# Altium schematic sheet Forward Loom.SchDoc
size A4; SheetNumber: 1; SheetTotal: 3
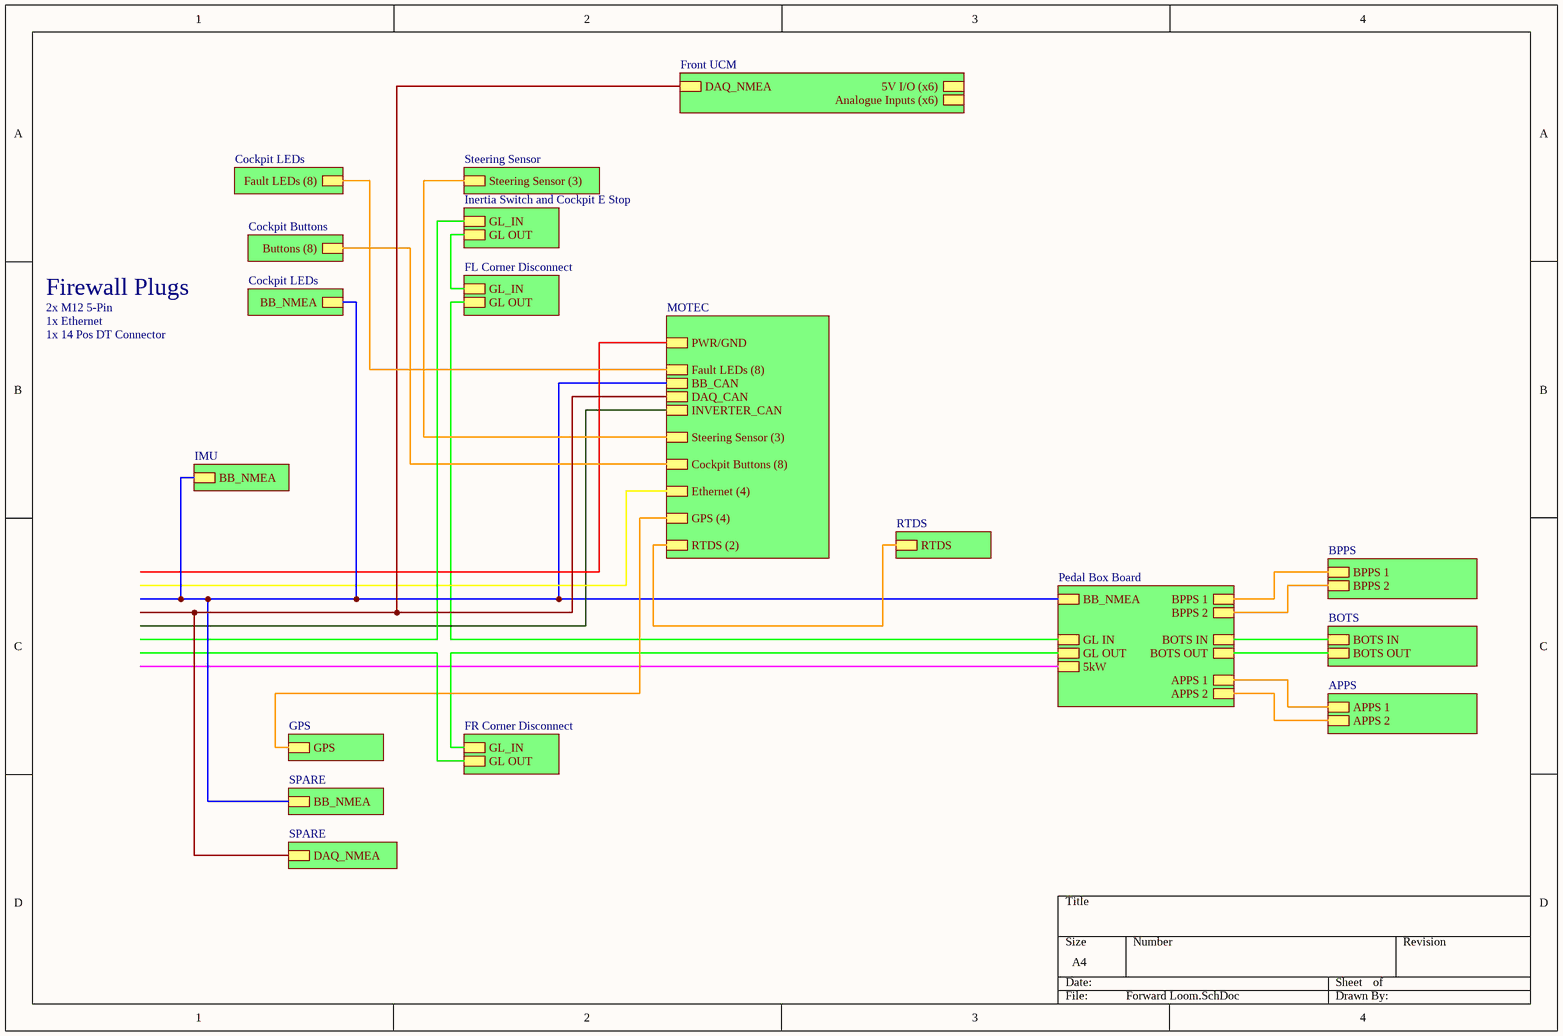
[diagram p0: Forward Loom.SchDoc]

## Sub-sheets
APPS = File Name: APPS 1, APPS 2
BOTS = File Name: BOTS IN, BOTS OUT
BPPS = File Name: BPPS 1, BPPS 2
Cockpit Buttons = File Name: Buttons (8)
Cockpit LEDs = File Name: BB_NMEA
Cockpit LEDs = File Name: Fault LEDs (8)
FL Corner Disconnect = File Name: GL_IN, GL OUT
FR Corner Disconnect = File Name: GL_IN, GL OUT
Front UCM = File Name: DAQ_NMEA, 5V I/O (x6), Analogue Inputs (x6)
GPS = File Name: GPS
IMU = File Name: BB_NMEA
Inertia Switch and Cockpit E Stop = File Name: GL_IN, GL OUT
MOTEC = File Name: PWR/GND, BB_CAN, DAQ_CAN, INVERTER_CAN, Steering Sensor (3), Cockpit Buttons (8), Ethernet (4), GPS (4), RTDS (2), Fault LEDs (8)
Pedal Box Board = File Name: BPPS 1, BPPS 2, BOTS IN, BOTS OUT, APPS 1, APPS 2, BB_NMEA, GL IN, GL OUT, 5kW
RTDS = File Name: RTDS
SPARE = File Name: BB_NMEA
SPARE = File Name: DAQ_NMEA
Steering Sensor = File Name: Steering Sensor (3)

## Nets
(unnamed): sheet Pedal Box Board/BPPS 1, sheet BPPS/BPPS 1
(unnamed): sheet Pedal Box Board/BPPS 2, sheet BPPS/BPPS 2
(unnamed): sheet Pedal Box Board/BOTS IN, sheet BOTS/BOTS IN
(unnamed): sheet Pedal Box Board/BOTS OUT, sheet BOTS/BOTS OUT
(unnamed): sheet Pedal Box Board/APPS 1, sheet APPS/APPS 1
(unnamed): sheet Pedal Box Board/APPS 2, sheet APPS/APPS 2
(unnamed): sheet Pedal Box Board/BB_NMEA, sheet MOTEC/BB_CAN, sheet IMU/BB_NMEA, sheet Cockpit LEDs/BB_NMEA, sheet SPARE/BB_NMEA
(unnamed): sheet Pedal Box Board/GL IN, sheet FL Corner Disconnect/GL OUT
(unnamed): sheet Pedal Box Board/GL OUT, sheet FR Corner Disconnect/GL_IN
(unnamed): sheet MOTEC/DAQ_CAN, sheet Front UCM/DAQ_NMEA, sheet SPARE/DAQ_NMEA
(unnamed): sheet MOTEC/Steering Sensor (3), sheet Steering Sensor/Steering Sensor (3)
(unnamed): sheet MOTEC/Cockpit Buttons (8), sheet Cockpit Buttons/Buttons (8)
(unnamed): sheet MOTEC/GPS (4), sheet GPS/GPS
(unnamed): sheet MOTEC/RTDS (2), sheet RTDS/RTDS
(unnamed): sheet MOTEC/Fault LEDs (8), sheet Cockpit LEDs/Fault LEDs (8)
(unnamed): sheet Inertia Switch and Cockpit E Stop/GL OUT, sheet FL Corner Disconnect/GL_IN

## Notes on the sheet
- Firewall Plugs
- 2x M12 5-Pin
- 1x Ethernet
- 1x 14 Pos DT Connector